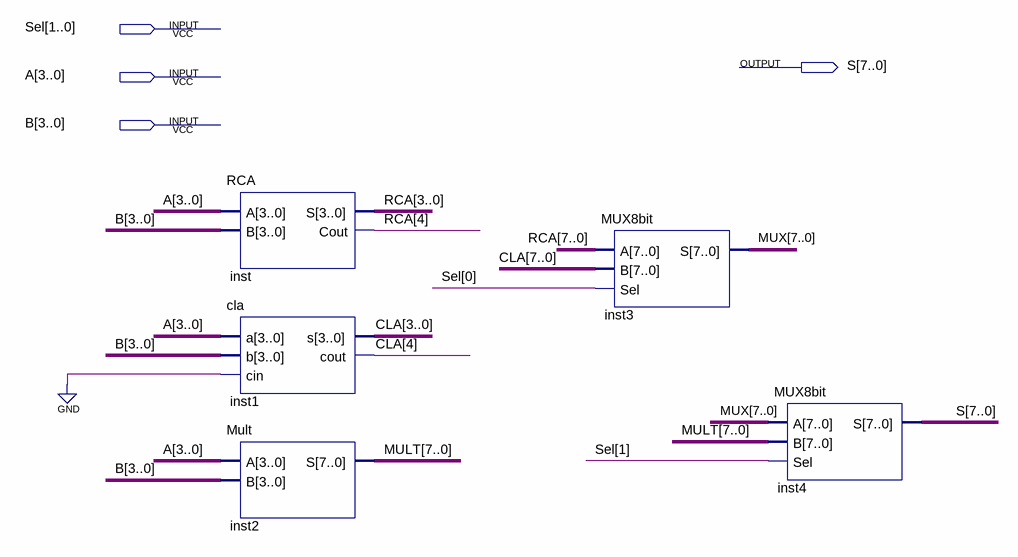
[diagram p0: schematic sheet]
// Quartus schematic Lab04.bdf as structural Verilog: 5 symbols, 4 pins
module Lab04 (
  input  [1:0] Sel,
  input  [3:0] A,
  input  [3:0] B,
  output [7:0] S
);

  wire [7:0] CLA, MULT, MUX, RCA;

  RCA inst (.A(A), .B(B), .S(RCA[3:0]), .Cout(RCA[4]));
  cla inst1 (.a(A), .b(B), .cin(1'b0), .s(CLA[3:0]), .cout(CLA[4]));
  Mult inst2 (.A(A), .B(B), .S(MULT));
  MUX8bit inst3 (.A(RCA), .B(CLA), .Sel(Sel[0]), .S(MUX));
  MUX8bit inst4 (.A(MUX), .B(MULT), .Sel(Sel[1]), .S(S));
endmodule
